# Altium schematic sheet stm32.SchDoc
size A4
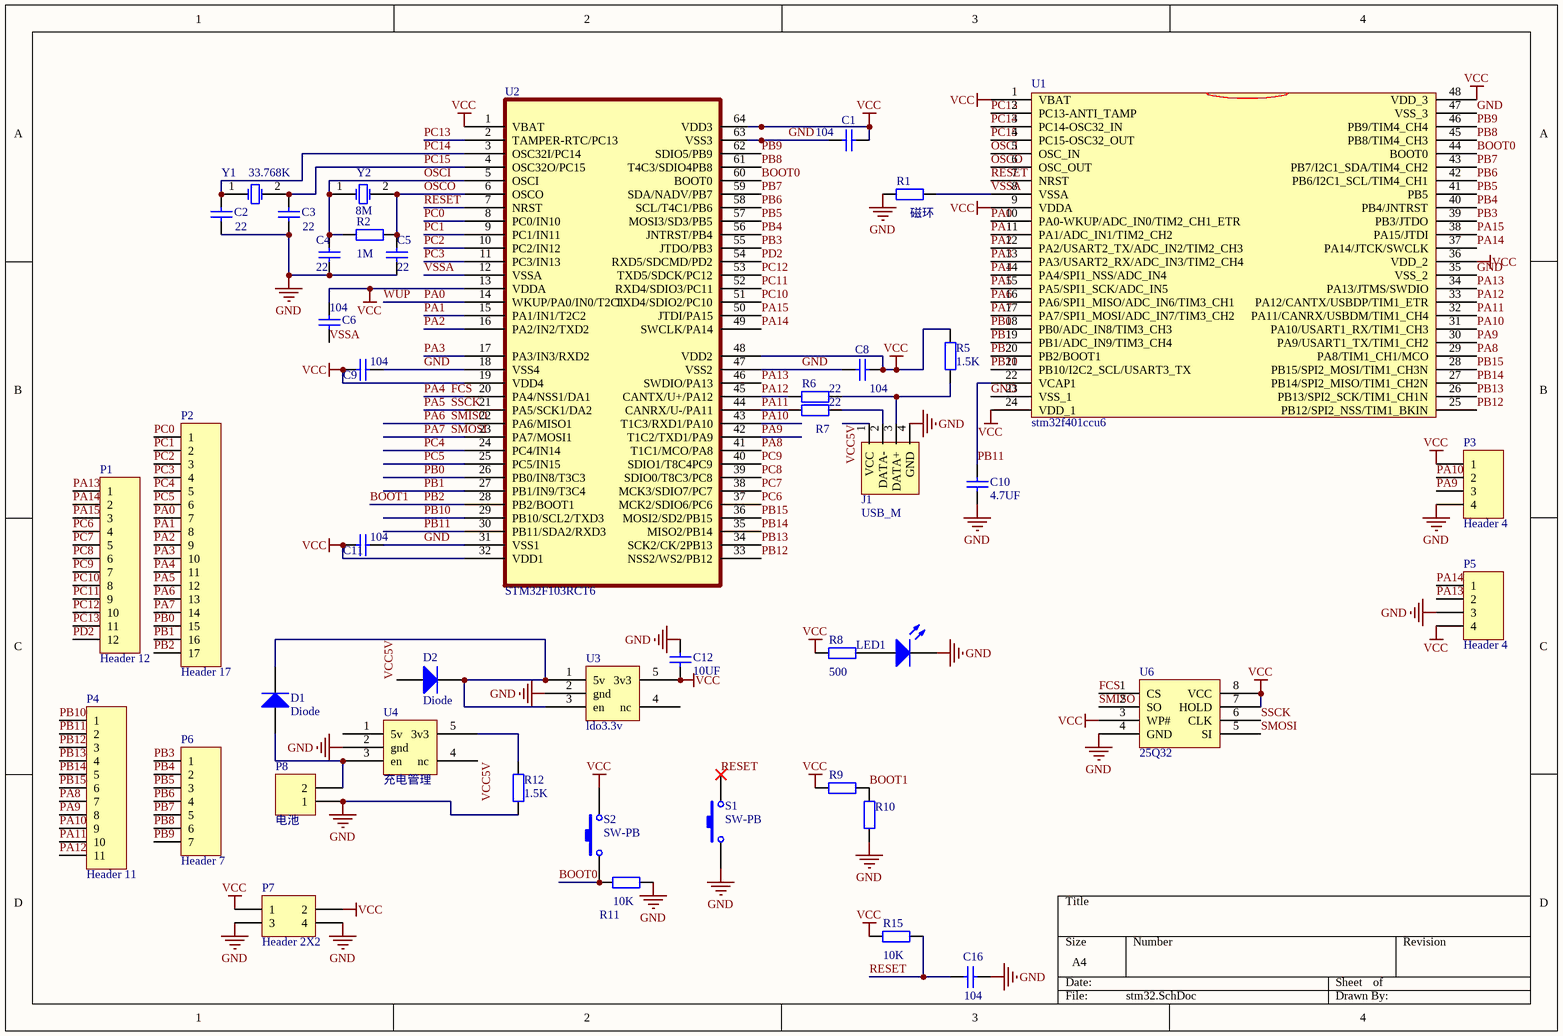
[diagram p0: stm32.SchDoc]

## Parts
C1  value 104  [6-0805_N]  (hidden comment: Cap)
C2  value 22  [6-0805_N]  (hidden comment: Cap)
C3  value 22  [6-0805_N]  (hidden comment: Cap)
C4  value 22  [6-0805_N]  (hidden comment: Cap)
C5  value 22  [6-0805_N]  (hidden comment: Cap)
C6  value 104  [6-0805_N]  (hidden comment: Cap)
C8  value 104  [6-0805_N]  (hidden comment: Cap)
C9  value 104  [6-0805_N]  (hidden comment: Cap)
C10  value 4.7UF  [6-0805_N]  (hidden comment: Cap)
C11  value 104  [6-0805_N]  (hidden comment: Cap)
C12  value 10UF  [6-0805_N]  (hidden comment: Cap)
C16  value 104  [6-0805_N]  (hidden comment: Cap)
D1  Diode  [6-0805_N]
D2  Diode  [6-0805_N]
J1  USB_M  [usb-micro插]
LED1  LED  [6-0805_N]  (value not drawn)
P1  Header 12  [HDR1X12]
P2  Header 17  [HDR1X17]
P3  Header 4  [HDR1X4]
P4  Header 11  [HDR1X11]
P5  Header 4  [HDR1X4]
P6  Header 7  [HDR1X7]
P7  Header 2X2  [HDR2X2]
P8  电池  [HDR1X2]
R1  value 磁环  [6-0805_N]  (hidden comment: 0)
R2  value 1M  [6-0805_N]  (hidden comment: Res2)
R5  value 1.5K  [6-0805_N]  (hidden comment: Res2)
R6  value 22  [6-0805_N]  (hidden comment: Res2)
R7  value 22  [6-0805_N]  (hidden comment: Res2)
R8  value 500  [6-0805_N]  (hidden comment: Res2)
R9  Res2  [0402]  (value not drawn)
R10  Res2  [0402]  (value not drawn)
R11  value 10K  [6-0805_N]  (hidden comment: Res2)
R12  value 1.5K  [6-0805_N]  (hidden comment: Res2)
R15  value 10K  [6-0805_N]  (hidden comment: Res2)
S1  SW-PB  [key]
S2  SW-PB  [key]
U1  stm32f401ccu6  [qfn48精简]
U2  STM32F103RCT6  [lqfd64正常]
U3  ldo3.3v  [sot23_5]
U4  充电管理  [sot23_5]
U6  25Q32  [sop8_w_f]
Y1  33.768K  [XTAL_32.768]
Y2  8M  [晶振2]

## Nets
GND: C1.2 C2.1 C3.1 C4.1 C5.1 C8.2 C9.2 C10.1 C11.2 C12.2 C16.2 J1.4(GND) LED1.2 P3.4 P5.3 P7.3 P7.4 P8.1 R1.2 R10.1 R11.2 R12.1 S1.1 U1.23(VSS_1) U1.35(VSS_2) U1.47(VSS_3) U2.18(VSS4) U2.31(VSS1) U2.47(VSS2) U2.63(VSS3) U3.2(gnd) U4.2(gnd) U6.4(GND)
VCC: C1.1 C6.1 C8.1 C9.1 C11.1 C12.1 P3.1 P5.4 P7.1 P7.2 R5.2 R8.1 R9.1 R15.1 S2.2 U1.1(VBAT) U1.9(VDDA) U1.24(VDD_1) U1.36(VDD_2) U1.48(VDD_3) U2.1(VBAT) U2.13(VDDA) U2.19(VDD4) U2.32(VDD1) U2.48(VDD2) U2.64(VDD3) U3.5(3v3) U6.3(WP#) U6.7(HOLD) U6.8(VCC)
BOOT0: R11.1 S2.1 U1.44(BOOT0) U2.60(BOOT0)
BOOT1: P2.17 R9.2 R10.2 U1.20(PB2/BOOT1) U2.28(PB2/BOOT1)  [also labelled PB2]
FCS: P2.11 U1.14(PA4/SPI1_NSS/ADC_IN4) U2.20(PA4/NSS1/DA1) U6.1(CS)  [also labelled PA4]
OSCI: C4.2 R2.1 U1.5(OSC_IN) U2.5(OSCI) Y2.1(OSC1)
OSCO: C5.2 R2.2 U1.6(OSC_OUT) U2.6(OSCO) Y2.2(OSC2)
PA0: P2.7 U1.10(PA0-WKUP/ADC_IN0/TIM2_CH1_ETR) U2.14(WKUP/PA0/IN0/T2C1)  [also labelled WUP]
PA1: P2.8 U1.11(PA1/ADC_IN1/TIM2_CH2) U2.15(PA1/IN1/T2C2)
PA2: P2.9 U1.12(PA2/USART2_TX/ADC_IN2/TIM2_CH3) U2.16(PA2/IN2/TXD2)
PA3: P2.10 U1.13(PA3/USART2_RX/ADC_IN3/TIM2_CH4) U2.17(PA3/IN3/RXD2)
PA5: P2.12 U1.15(PA5/SPI1_SCK/ADC_IN5) U2.21(PA5/SCK1/DA2) U6.6(CLK)  [also labelled SSCK]
PA6: P2.13 U1.16(PA6/SPI1_MISO/ADC_IN6/TIM3_CH1) U2.22(PA6/MISO1) U6.2(SO)  [also labelled SMISO]
PA7: P2.14 U1.17(PA7/SPI1_MOSI/ADC_IN7/TIM3_CH2) U2.23(PA7/MOSI1) U6.5(SI)  [also labelled SMOSI]
PA8: P4.7 U1.29(PA8/TIM1_CH1/MCO) U2.41(T1C1/MCO/PA8)
PA9: P3.3 P4.8 U1.30(PA9/USART1_TX/TIM1_CH2) U2.42(T1C2/TXD1/PA9)
PA10: P3.2 P4.9 U1.31(PA10/USART1_RX/TIM1_CH3) U2.43(T1C3/RXD1/PA10)
PA11: P4.10 R7.1 U1.32(PA11/CANRX/USBDM/TIM1_CH4) U2.44(CANRX/U-/PA11)
PA12: P4.11 R6.1 U1.33(PA12/CANTX/USBDP/TIM1_ETR) U2.45(CANTX/U+/PA12)
PA13: P1.1 P5.2 U1.34(PA13/JTMS/SWDIO) U2.46(SWDIO/PA13)
PA14: P1.2 P5.1 U1.37(PA14/JTCK/SWCLK) U2.49(SWCLK/PA14)
PA15: P1.3 U1.38(PA15/JTDI) U2.50(JTDI/PA15)
PB0: P2.15 U1.18(PB0/ADC_IN8/TIM3_CH3) U2.26(PB0/IN8/T3C3)
PB1: P2.16 U1.19(PB1/ADC_IN9/TIM3_CH4) U2.27(PB1/IN9/T3C4)
PB3: P6.1 U1.39(PB3/JTDO) U2.55(JTDO/PB3)
PB4: P6.2 U1.40(PB4/JNTRST) U2.56(JNTRST/PB4)
PB5: P6.3 U1.41(PB5) U2.57(MOSI3/SD3/PB5)
PB6: P6.4 U1.42(PB6/I2C1_SCL/TIM4_CH1) U2.58(SCL/T4C1/PB6)
PB7: P6.5 U1.43(PB7/I2C1_SDA/TIM4_CH2) U2.59(SDA/NADV/PB7)
PB8: P6.6 U1.45(PB8/TIM4_CH3) U2.61(T4C3/SDIO4PB8)
PB9: P6.7 U1.46(PB9/TIM4_CH4) U2.62(SDIO5/PB9)
PB10: P4.1 U1.21(PB10/I2C2_SCL/USART3_TX) U2.29(PB10/SCL2/TXD3)
PB11: C10.2 P4.2 U1.22(VCAP1) U2.30(PB11/SDA2/RXD3)
PB12: P4.3 U1.25(PB12/SPI2_NSS/TIM1_BKIN) U2.33(NSS2/WS2/PB12)
PB13: P4.4 U1.26(PB13/SPI2_SCK/TIM1_CH1N) U2.34(SCK2/CK/2PB13)
PB14: P4.5 U1.27(PB14/SPI2_MISO/TIM1_CH2N) U2.35(MISO2/PB14)
PB15: P4.6 U1.28(PB15/SPI2_MOSI/TIM1_CH3N) U2.36(MOSI2/SD2/PB15)
PC0: P2.1 U2.8(PC0/IN10)
PC1: P2.2 U2.9(PC1/IN11)
PC2: P2.3 U2.10(PC2/IN12)
PC3: P2.4 U2.11(PC3/IN13)
PC4: P2.5 U2.24(PC4/IN14)
PC5: P2.6 U2.25(PC5/IN15)
PC6: P1.4 U2.37(MCK2/SDIO6/PC6)
PC7: P1.5 U2.38(MCK3/SDIO7/PC7)
PC8: P1.6 U2.39(SDIO0/T8C3/PC8)
PC9: P1.7 U2.40(SDIO1/T8C4PC9)
PC10: P1.8 U2.51(TXD4/SDIO2/PC10)
PC11: P1.9 U2.52(RXD4/SDIO3/PC11)
PC12: P1.10 U2.53(TXD5/SDCK/PC12)
PC13: P1.11 U1.2(PC13-ANTI_TAMP) U2.2(TAMPER-RTC/PC13)
PC14: C2.2 U1.3(PC14-OSC32_IN) U2.3(OSC32I/PC14) Y1.1(OSC1)
PC15: C3.2 U1.4(PC15-OSC32_OUT) U2.4(OSC32O/PC15) Y1.2(OSC2)
PD2: P1.12 U2.54(RXD5/SDCMD/PD2)
RESET: C16.1 R15.2 S1.2 U1.7(NRST) U2.7(NRST)
VCC5V: D2.1(A) J1.1(VCC) U4.4(nc)
VSSA: C6.2 R1.1 U1.8(VSSA) U2.12(VSSA)
NetD1_1: D1.1(A) P8.2 U4.3(en)
NetD1_2: D1.2(K) D2.2(K) U3.1(5v) U3.3(en)
NetJ1_2: J1.2(DATA-) R7.2
NetJ1_3: J1.3(DATA+) R5.1 R6.2
NetLED1_1: LED1.1 R8.2
NetR12_2: R12.2 U4.5(3v3)

Not connected (* = marked no-connect by the designer): U3 4(nc); U4 1(5v)

## Library data of the parts
C1-C6 C8-C12 C16 = Cap: Capacitor; Published: 8-Jun-2000; LatestRevisionDate: 17-Jul-2002; LatestRevisionNote: Re-released for DXP Platform.; PackageReference: RAD-0.3; Publisher: Altium Limited; PackageDescription: Radial Cap, Thru-Hole; 2 Leads; 0.3 in Pin Spacing
D1 D2 = Diode: Default Diode; Published: 8-Jun-2000; LatestRevisionDate: 17-Jul-2002; LatestRevisionNote: Re-released for DXP Platform.; PackageVersion: Sep-1996; PackageReference: SMC; Publisher: Altium Limited; PackageDescription: DO-214-AB/SMC; 2 C-Bend Leads; Body 7.9 x 5.9 mm, inc. leads (LxW); Code_JEDEC: DO-214-AB
LED1 = 发光二极管
P1 = Header 12: Header, 12-Pin; LatestRevisionDate: 17-Jul-2002; LatestRevisionNote: Re-released for DXP Platform.; Publisher: Altium Limited
P2 = Header 17: Header, 17-Pin; LatestRevisionDate: 17-Jul-2002; LatestRevisionNote: Re-released for DXP Platform.; Publisher: Altium Limited
P3 P5 = Header 4: Header, 4-Pin; LatestRevisionDate: 17-Jul-2002; LatestRevisionNote: Re-released for DXP Platform.; Publisher: Altium Limited
P4 = Header 11: Header, 11-Pin; LatestRevisionDate: 17-Jul-2002; LatestRevisionNote: Re-released for DXP Platform.; Publisher: Altium Limited
P6 = Header 7: Header, 7-Pin; LatestRevisionDate: 17-Jul-2002; LatestRevisionNote: Re-released for DXP Platform.; Publisher: Altium Limited
P7 = Header 2X2: Header, 2-Pin, Dual row; LatestRevisionDate: 17-Jul-2002; LatestRevisionNote: Re-released for DXP Platform.; Publisher: Altium Limited
P8 = Header 2: Header, 2-Pin; LatestRevisionDate: 17-Jul-2002; LatestRevisionNote: Re-released for DXP Platform.; Publisher: Altium Limited
R1 R2 R5-R8 R11 R12 R15 = Res2: Resistor; Published: 8-Jun-2000; LatestRevisionDate: 17-Jul-2002; LatestRevisionNote: Re-released for DXP Platform.; PackageReference: AXIAL-0.4; Publisher: Altium Limited; PackageDescription: Axial Device, Thru-Hole; 2 Leads; 0.4 in Pin Spacing
R9 R10 = Res2: Resistor; Value: 10K; Published: 8-Jun-2000; LatestRevisionDate: 17-Jul-2002; LatestRevisionNote: Re-released for DXP Platform.; PackageReference: AXIAL-0.4; Publisher: Altium Limited; PackageDescription: Axial Device, Thru-Hole; 2 Leads; 0.4 in Pin Spacing
S1 S2 = SW-PB: Switch; Published: 24-Mar-1999; LatestRevisionDate: 17-Jul-2002; LatestRevisionNote: Re-released for DXP Platform.; PackageReference: SPST-2; Publisher: Altium Limited; PackageDescription: Switch; 2 Leads
U1 U3 U4 U6 = Component_1
U2 = STM32F103RDT6: ST High-density performance line ARM-based 32-bit MCU with 256 to  512KB Flash, USB, CAN, 11 timers, 3 ADCs, 13 communication interfaces
Y1 Y2 = 晶振